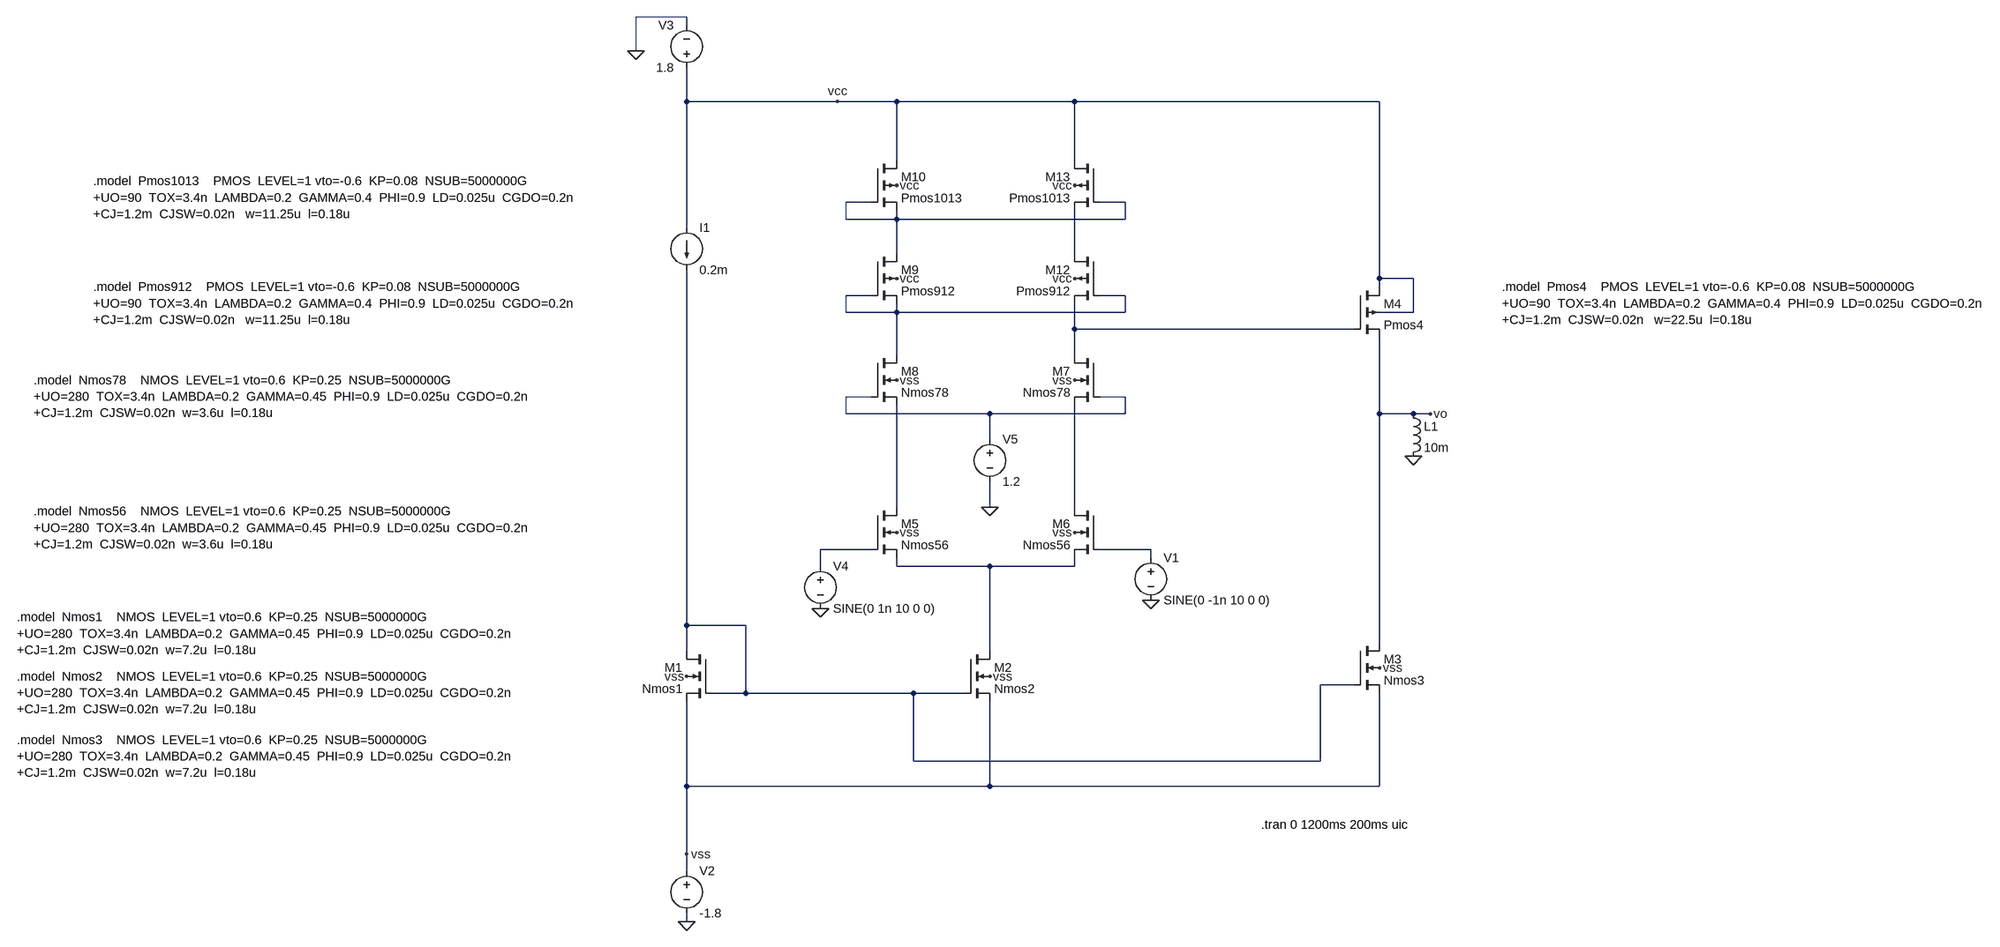
[diagram p0: schematic project2.asc]
project2.asc, the LTspice schematic file:
Version 4
SHEET 1 2228 1360
WIRE -800 -1392 -896 -1392
WIRE -800 -1376 -800 -1392
WIRE -896 -1328 -896 -1392
WIRE -800 -1232 -800 -1296
WIRE -512 -1232 -800 -1232
WIRE -400 -1232 -512 -1232
WIRE -64 -1232 -400 -1232
WIRE 512 -1232 -64 -1232
WIRE -400 -960 -400 -1232
WIRE -64 -960 -64 -1232
WIRE -448 -880 -496 -880
WIRE 32 -880 -16 -880
WIRE -496 -848 -496 -880
WIRE -400 -848 -400 -864
WIRE -400 -848 -496 -848
WIRE 32 -848 32 -880
WIRE 32 -848 -400 -848
WIRE -800 -832 -800 -1232
WIRE -400 -784 -400 -848
WIRE -64 -784 -64 -864
WIRE 512 -736 512 -1232
WIRE 576 -736 512 -736
WIRE 512 -720 512 -736
WIRE -448 -704 -496 -704
WIRE 32 -704 -16 -704
WIRE -496 -672 -496 -704
WIRE -400 -672 -400 -688
WIRE -400 -672 -496 -672
WIRE 32 -672 32 -704
WIRE 32 -672 -400 -672
WIRE 576 -672 576 -736
WIRE 576 -672 512 -672
WIRE -64 -640 -64 -688
WIRE 464 -640 -64 -640
WIRE -400 -592 -400 -672
WIRE -64 -592 -64 -640
WIRE -448 -512 -496 -512
WIRE 32 -512 -16 -512
WIRE -496 -480 -496 -512
WIRE -224 -480 -496 -480
WIRE 32 -480 32 -512
WIRE 32 -480 -224 -480
WIRE 512 -480 512 -624
WIRE 576 -480 512 -480
WIRE 608 -480 576 -480
WIRE -224 -432 -224 -480
WIRE -400 -304 -400 -496
WIRE -224 -304 -224 -352
WIRE -64 -304 -64 -496
WIRE -448 -224 -544 -224
WIRE 80 -224 -16 -224
WIRE 80 -208 80 -224
WIRE -544 -192 -544 -224
WIRE -400 -192 -400 -208
WIRE -224 -192 -400 -192
WIRE -64 -192 -64 -208
WIRE -64 -192 -224 -192
WIRE -800 -80 -800 -752
WIRE -688 -80 -800 -80
WIRE 512 -48 512 -480
WIRE -800 -32 -800 -80
WIRE -224 -32 -224 -192
WIRE 464 32 400 32
WIRE -688 48 -688 -80
WIRE -688 48 -752 48
WIRE -368 48 -688 48
WIRE -272 48 -368 48
WIRE -368 176 -368 48
WIRE 400 176 400 32
WIRE 400 176 -368 176
WIRE -800 224 -800 64
WIRE -224 224 -224 64
WIRE -224 224 -800 224
WIRE 512 224 512 48
WIRE 512 224 -224 224
WIRE -800 352 -800 224
WIRE -800 384 -800 352
WIRE -800 480 -800 464
FLAG -800 480 0
FLAG -896 -1328 0
FLAG -544 -112 0
FLAG 80 -128 0
FLAG -512 -1232 vcc
FLAG -400 -912 vcc
FLAG -64 -912 vcc
FLAG -400 -736 vcc
FLAG -64 -736 vcc
FLAG -800 352 vss
FLAG -400 -544 vss
FLAG -64 -544 vss
FLAG -64 -256 vss
FLAG -400 -256 vss
FLAG -800 16 vss
FLAG -224 16 vss
FLAG 512 0 vss
FLAG -224 -304 0
FLAG 608 -480 vo
FLAG 576 -400 0
SYMBOL current -800 -832 R0
SYMATTR InstName I1
SYMATTR Value 0.2m
SYMBOL nmos4 -752 -32 M0
SYMATTR InstName M1
SYMATTR Value Nmos1
SYMBOL nmos4 -272 -32 R0
SYMATTR InstName M2
SYMATTR Value Nmos2
SYMBOL nmos4 464 -48 R0
SYMATTR InstName M3
SYMATTR Value Nmos3
SYMBOL nmos4 -448 -304 R0
SYMATTR InstName M5
SYMATTR Value Nmos56
SYMBOL nmos4 -16 -304 M0
SYMATTR InstName M6
SYMATTR Value Nmos56
SYMBOL nmos4 -16 -592 M0
SYMATTR InstName M7
SYMATTR Value Nmos78
SYMBOL nmos4 -448 -592 R0
SYMATTR InstName M8
SYMATTR Value Nmos78
SYMBOL pmos4 -448 -784 R0
SYMATTR InstName M9
SYMATTR Value Pmos912
SYMBOL pmos4 -448 -960 R0
SYMATTR InstName M10
SYMATTR Value Pmos1013
SYMBOL pmos4 -16 -784 M0
SYMATTR InstName M12
SYMATTR Value Pmos912
SYMBOL pmos4 -16 -960 M0
SYMATTR InstName M13
SYMATTR Value Pmos1013
SYMBOL voltage 80 -224 R0
WINDOW 123 0 0 Left 0
WINDOW 39 0 0 Left 0
SYMATTR InstName V1
SYMATTR Value SINE(0 -1n 10 0 0)
SYMBOL voltage -544 -208 R0
WINDOW 123 0 0 Left 0
WINDOW 39 0 0 Left 0
SYMATTR InstName V4
SYMATTR Value SINE(0 1n 10 0 0)
SYMBOL voltage -800 -1280 R180
WINDOW 0 24 96 Left 2
WINDOW 3 24 16 Left 2
WINDOW 123 0 0 Left 0
WINDOW 39 0 0 Left 0
SYMATTR InstName V3
SYMATTR Value 1.8
SYMBOL voltage -800 368 R0
WINDOW 123 0 0 Left 0
WINDOW 39 0 0 Left 0
SYMATTR InstName V2
SYMATTR Value -1.8
SYMBOL pmos4 464 -720 R0
SYMATTR InstName M4
SYMATTR Value Pmos4
SYMBOL voltage -224 -448 R0
WINDOW 123 0 0 Left 0
WINDOW 39 0 0 Left 0
SYMATTR InstName V5
SYMATTR Value 1.2
SYMBOL ind 560 -496 R0
SYMATTR InstName L1
SYMATTR Value 10m
SYMATTR SpiceLine Ipk=1m
TEXT 288 296 Left 2 !.tran 0 1200ms 200ms uic
TEXT -2240 -96 Left 2 !.model  Nmos1    NMOS  LEVEL=1 vto=0.6  KP=0.25  NSUB=5000000G\n+UO=280  TOX=3.4n  LAMBDA=0.2  GAMMA=0.45  PHI=0.9  LD=0.025u  CGDO=0.2n\n+CJ=1.2m  CJSW=0.02n  w=7.2u  l=0.18u
TEXT -2096 -920 Left 2 !.model  Pmos1013    PMOS  LEVEL=1 vto=-0.6  KP=0.08  NSUB=5000000G\n+UO=90  TOX=3.4n  LAMBDA=0.2  GAMMA=0.4  PHI=0.9  LD=0.025u  CGDO=0.2n\n+CJ=1.2m  CJSW=0.02n   w=11.25u  l=0.18u
TEXT -2096 -720 Left 2 !.model  Pmos912    PMOS  LEVEL=1 vto=-0.6  KP=0.08  NSUB=5000000G\n+UO=90  TOX=3.4n  LAMBDA=0.2  GAMMA=0.4  PHI=0.9  LD=0.025u  CGDO=0.2n\n+CJ=1.2m  CJSW=0.02n   w=11.25u  l=0.18u
TEXT -2208 -544 Left 2 !.model  Nmos78    NMOS  LEVEL=1 vto=0.6  KP=0.25  NSUB=5000000G\n+UO=280  TOX=3.4n  LAMBDA=0.2  GAMMA=0.45  PHI=0.9  LD=0.025u  CGDO=0.2n\n+CJ=1.2m  CJSW=0.02n  w=3.6u  l=0.18u
TEXT -2208 -296 Left 2 !.model  Nmos56    NMOS  LEVEL=1 vto=0.6  KP=0.25  NSUB=5000000G\n+UO=280  TOX=3.4n  LAMBDA=0.2  GAMMA=0.45  PHI=0.9  LD=0.025u  CGDO=0.2n\n+CJ=1.2m  CJSW=0.02n  w=3.6u  l=0.18u
TEXT -2240 16 Left 2 !.model  Nmos2    NMOS  LEVEL=1 vto=0.6  KP=0.25  NSUB=5000000G\n+UO=280  TOX=3.4n  LAMBDA=0.2  GAMMA=0.45  PHI=0.9  LD=0.025u  CGDO=0.2n\n+CJ=1.2m  CJSW=0.02n  w=7.2u  l=0.18u
TEXT -2240 136 Left 2 !.model  Nmos3    NMOS  LEVEL=1 vto=0.6  KP=0.25  NSUB=5000000G\n+UO=280  TOX=3.4n  LAMBDA=0.2  GAMMA=0.45  PHI=0.9  LD=0.025u  CGDO=0.2n\n+CJ=1.2m  CJSW=0.02n  w=7.2u  l=0.18u
TEXT 880 -720 Left 2 !.model  Pmos4    PMOS  LEVEL=1 vto=-0.6  KP=0.08  NSUB=5000000G\n+UO=90  TOX=3.4n  LAMBDA=0.2  GAMMA=0.4  PHI=0.9  LD=0.025u  CGDO=0.2n\n+CJ=1.2m  CJSW=0.02n   w=22.5u  l=0.18u

The netlist it stands for:
* project2.asc
I1 vcc N011 0.2m
M1 N011 N011 vss vss Nmos1
M2 N010 N011 vss vss Nmos2
M3 vo N011 vss vss Nmos3
M5 N006 N008 N010 vss Nmos56
M6 N007 N009 N010 vss Nmos56
M7 N004 N005 N007 vss Nmos78
M8 N003 N005 N006 vss Nmos78
M9 N001 N003 N003 vcc Pmos912
M10 vcc N001 N001 vcc Pmos1013
M12 N002 N003 N004 vcc Pmos912
M13 vcc N001 N002 vcc Pmos1013
V1 N009 0 SINE(0 -1n 10 0 0)
V4 N008 0 SINE(0 1n 10 0 0)
V3 vcc 0 1.8
V2 vss 0 -1.8
M4 vcc N004 vo vcc Pmos4
V5 N005 0 1.2
L1 vo 0 10m Ipk=1m
.model NMOS NMOS
.model PMOS PMOS
.lib standard.mos
.tran 0 1200ms 200ms uic
.model  Nmos1    NMOS  LEVEL=1 vto=0.6  KP=0.25  NSUB=5000000G
+UO=280  TOX=3.4n  LAMBDA=0.2  GAMMA=0.45  PHI=0.9  LD=0.025u  CGDO=0.2n
+CJ=1.2m  CJSW=0.02n  w=7.2u  l=0.18u
.model  Pmos1013    PMOS  LEVEL=1 vto=-0.6  KP=0.08  NSUB=5000000G
+UO=90  TOX=3.4n  LAMBDA=0.2  GAMMA=0.4  PHI=0.9  LD=0.025u  CGDO=0.2n
+CJ=1.2m  CJSW=0.02n   w=11.25u  l=0.18u
.model  Pmos912    PMOS  LEVEL=1 vto=-0.6  KP=0.08  NSUB=5000000G
+UO=90  TOX=3.4n  LAMBDA=0.2  GAMMA=0.4  PHI=0.9  LD=0.025u  CGDO=0.2n
+CJ=1.2m  CJSW=0.02n   w=11.25u  l=0.18u
.model  Nmos78    NMOS  LEVEL=1 vto=0.6  KP=0.25  NSUB=5000000G
+UO=280  TOX=3.4n  LAMBDA=0.2  GAMMA=0.45  PHI=0.9  LD=0.025u  CGDO=0.2n
+CJ=1.2m  CJSW=0.02n  w=3.6u  l=0.18u
.model  Nmos56    NMOS  LEVEL=1 vto=0.6  KP=0.25  NSUB=5000000G
+UO=280  TOX=3.4n  LAMBDA=0.2  GAMMA=0.45  PHI=0.9  LD=0.025u  CGDO=0.2n
+CJ=1.2m  CJSW=0.02n  w=3.6u  l=0.18u
.model  Nmos2    NMOS  LEVEL=1 vto=0.6  KP=0.25  NSUB=5000000G
+UO=280  TOX=3.4n  LAMBDA=0.2  GAMMA=0.45  PHI=0.9  LD=0.025u  CGDO=0.2n
+CJ=1.2m  CJSW=0.02n  w=7.2u  l=0.18u
.model  Nmos3    NMOS  LEVEL=1 vto=0.6  KP=0.25  NSUB=5000000G
+UO=280  TOX=3.4n  LAMBDA=0.2  GAMMA=0.45  PHI=0.9  LD=0.025u  CGDO=0.2n
+CJ=1.2m  CJSW=0.02n  w=7.2u  l=0.18u
.model  Pmos4    PMOS  LEVEL=1 vto=-0.6  KP=0.08  NSUB=5000000G
+UO=90  TOX=3.4n  LAMBDA=0.2  GAMMA=0.4  PHI=0.9  LD=0.025u  CGDO=0.2n
+CJ=1.2m  CJSW=0.02n   w=22.5u  l=0.18u
.backanno
.end